# EAGLE schematic pc_badge_hrv (EAGLE 6.6.0)

## Sheet 1 of 3
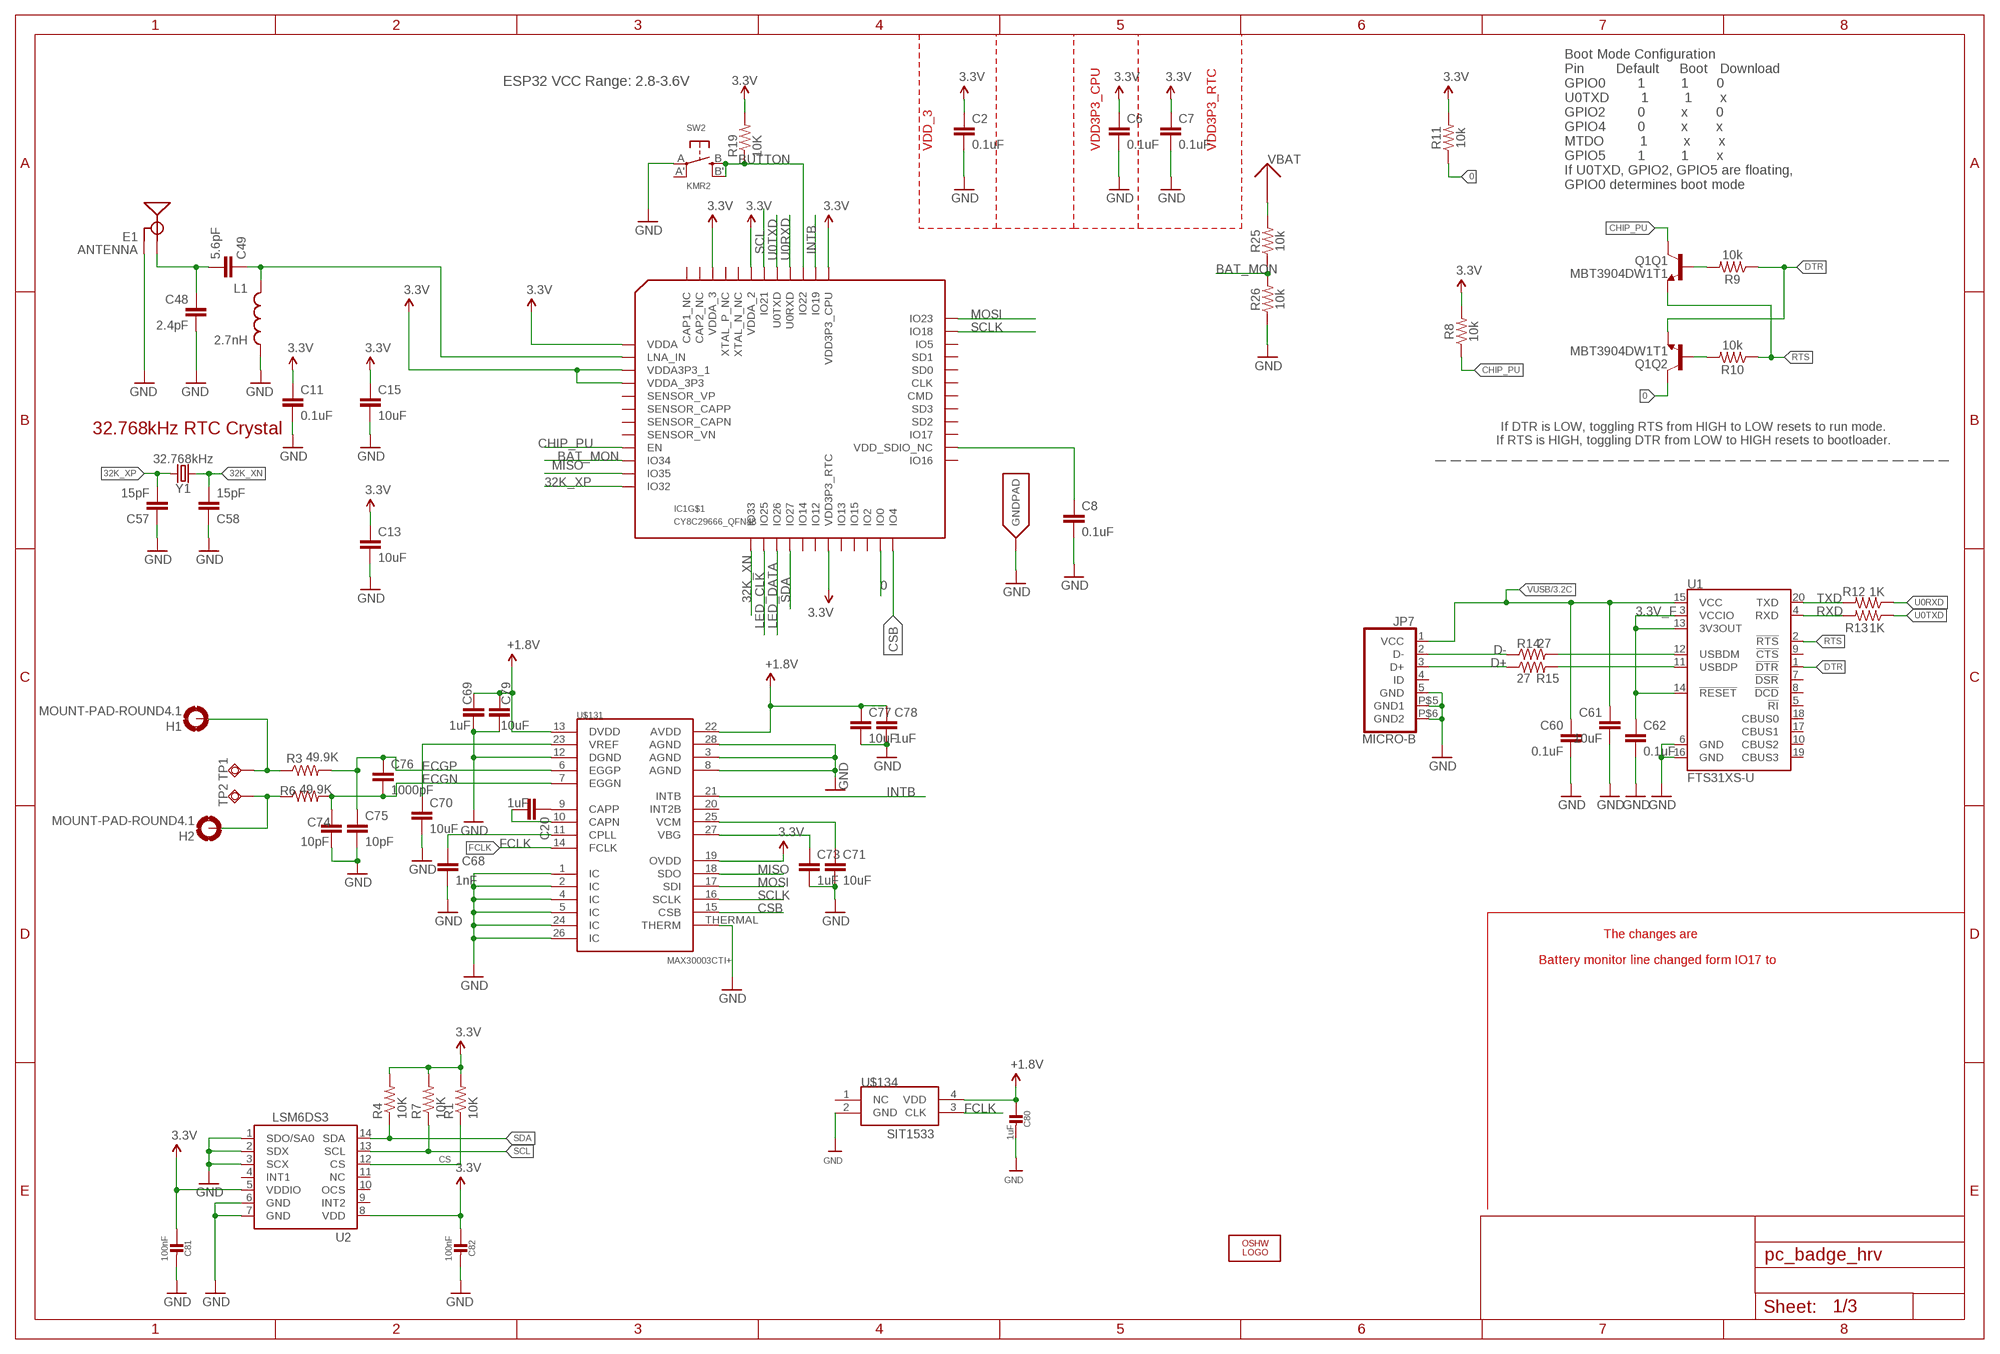
[diagram p0: schematic, sheet 1]

### Parts
C2  0.1uF  0.1UF-0402-16V-10%  [0402]
C6  0.1uF  0.1UF-0402-16V-10%  [0402]
C7  0.1uF  0.1UF-0402-16V-10%  [0402]
C8  0.1uF  0.1UF-0402-16V-10%  [0402]
C11  0.1uF  0.1UF-0402-16V-10%  [0402]
C13  10uF  10UF-0603-6.3V-20%  [0603]
C15  10uF  10UF-0603-6.3V-20%  [0603]
C20  1uF  C-EUC0402  [C0402]
C48  2.4pF  2.4PF-0603-50V-5%  [0603]
C49  5.6pF  5.6PF-50V-5%(0603)  [0603]
C57  15pF  15PF-0603-50V-5%  [0603]
C58  15pF  15PF-0603-50V-5%  [0603]
C60  0.1uF  C-EUC0402  [C0402]
C61  10uF  C-EUC0805  [C0805]
C62  0.1uF  C-EUC0402  [C0402]
C68  1nF  C-EUC0402  [C0402]
C69  1uF  C-EUC0402  [C0402]
C70  10uF  C-EUC0402  [C0402]
C71  10uF  C-EUC0402  [C0402]
C73  1uF  C-EUC0402  [C0402]
C74  10pF  C-EUC0402  [C0402]
C75  10pF  C-EUC0402  [C0402]
C76  1000pF  C-EUC0402  [C0402]
C77  10uF  C-EUC0402  [C0402]
C78  1uF  C-EUC0402  [C0402]
C79  10uF  C-EUC0402  [C0402]
C80  1uF  CAP_CERAMIC_0402  [_0402]
C81  100nF  CAP_CERAMIC_0402  [_0402]
C82  100nF  CAP_CERAMIC_0402  [_0402]
E1  ANTENNA  ANTENNATRACE-TUNED  [TRACE_ANTENNA_2.4GHZ_25.7MM_TUNED]
H1  MOUNT-PAD-ROUND4.1  [4,1-PAD]
H2  MOUNT-PAD-ROUND4.1  [4,1-PAD]
IC1  CY8C29666_QFN48  [QFN48]
JP7  MICRO-B  [MICRO-B]
L1  2.7nH  INDUCTOR0603  [0603]
LOGO3  OSHW_LOGO_FILLX0200-NT  [OSHW_FILLX200_NOTEXT]
Q1  MBT3904DW1T1  [SC70-6]
R1  10K  RESISTOR0402-RES  [0402-RES]
R3  49.9K  RESISTOR0402-RES  [0402-RES]
R4  10K  RESISTOR0402-RES  [0402-RES]
R6  49.9K  RESISTOR0402-RES  [0402-RES]
R7  10K  RESISTOR0402-RES  [0402-RES]
R8  10k  10KOHM-1/10W-1%(0603)0603  [0603]
R9  10k  10KOHM-0603-1/10W-1%  [0603]
R10  10k  10KOHM-0603-1/10W-1%  [0603]
R11  10k  10KOHM-1/10W-1%(0603)0603  [0603]
R12  1K  R-US_R0402  [R0402]
R13  1K  R-US_R0402  [R0402]
R14  27  R-US_R0402  [R0402]
R15  27  R-US_R0402  [R0402]
R19  10K  R-US_R0402  [R0402]
R25  10k  10KOHM-1/10W-1%(0603)0603  [0603]
R26  10k  10KOHM-1/10W-1%(0603)0603  [0603]
SW2  KMR2  SWITCH_TACT_SMT4.6X2.8  [BTN_KMR2_4.6X2.8]
TP1  TPSQTP11R  [TP11R]
TP2  TPSQTP11R  [TP11R]
U1  FTS31XS-U  FT231XS  [SSOP20_L]
U2  LSM6DS3  [LGA14L]
U$131  MAX30003CTI+  MAX30003  [QFN-28]
U$134  SIT1533  [SIT1533]
Y1  32.768kHz  CRYSTAL-32.768KHZSMD-3.2X1.5  [CRYSTAL-SMD-3.2X1.5MM]

### Nets
0: IC1.23(IO0) Q1.6(Q2:C) R11.1
3.3V: C2.1 C6.1 C7.1 C11.1 C13.1 C15.1 C81.1 C82.1 IC1.1(VDDA) IC1.3(VDDA3P3_1) IC1.4(VDDA_3P3) IC1.19(VDD3P3_RTC) IC1.37(VDD3P3_CPU) IC1.43(VDDA_2) IC1.46(VDDA_3) R1.2 R4.2 R7.2 R8.2 R11.2 R19.2 U2.5(VDDIO) U2.8(VDD) U$131.19(OVDD) ; also sheet 3
3.3V_F: C62.1 U1.3(VCCIO) U1.13(3V3OUT) U1.14(!RESET)
32K_XN: C58.2 IC1.13(IO33) Y1.P$2
32K_XP: C57.2 IC1.12(IO32) Y1.P$1
+1.8V: C69.1 C77.1 C78.1 C79.1 C80.1 U$131.13(DVDD) U$131.22(AVDD) U$134.4(VDD)
BAT_MON: IC1.10(IO34) R25.1 R26.2
BUTTON: IC1.39(IO22) R19.1 SW2.B'(S1) SW2.B(S)
CHIP_PU: IC1.9(EN) Q1.3(Q1:C) R8.1
CS: R1.1 U2.12(CS)
CSB: IC1.24(IO4) U$131.15(CSB)
D+: JP7.3(D+) R15.1
D-: JP7.2(D-) R14.1
DTR: Q1.1(Q2:E) R9.1 U1.1(!DTR)
ECG_N: H2.B4,1(MOUNT) R6.1 TP2.TP
ECG_P: H1.B4,1(MOUNT) R3.1 TP1.TP
ECGN: C74.1 C76.2 R6.2 U$131.7(EGGN)
ECGP: C75.1 C76.1 R3.2 U$131.6(EGGP)
FCLK: U$131.14(FCLK) U$134.3(CLK)
GND: C2.2 C6.2 C7.2 C8.2 C11.2 C13.2 C15.2 C48.2 C57.1 C58.1 C60.2 C61.2 C62.2 C68.2 C69.2 C70.2 C71.2 C73.2 C74.2 C75.2 C77.2 C78.2 C79.2 C80.2 C81.2 C82.2 E1.GND E1.GND2(GND) IC1.EXP(GNDPAD) JP7.5(GND) JP7.P$5(GND1) JP7.P$6(GND2) L1.2 R26.1 SW2.A(P) U1.6(GND) U1.16(GND) U2.1(SDO/SA0) U2.2(SDX) U2.3(SCX) U2.6(GND) U2.7(GND) U$131.1(IC) U$131.2(IC) U$131.3(AGND) U$131.4(IC) U$131.5(IC) U$131.8(AGND) U$131.12(DGND) U$131.24(IC) U$131.26(IC) U$131.28(AGND) U$131.THERMAL(THERM) U$134.2(GND) ; also sheet 2,3
INTB: IC1.38(IO19) U$131.21(INTB)
LED_CLK: IC1.14(IO25) ; also sheet 2
LED_DATA: IC1.15(IO26) ; also sheet 2
LNA_IN: C49.1 IC1.2(LNA_IN) L1.1
MISO: IC1.11(IO35) U$131.18(SDO)
MOSI: IC1.36(IO23) U$131.17(SDI)
N$1: C8.1 IC1.26(VDD_SDIO_NC)
N$4: Q1.5(Q1:B) R9.2
N$9: Q1.2(Q2:B) R10.2
N$20: R14.2 U1.12(USBDM)
N$21: R15.2 U1.11(USBDP)
N$270: C68.1 U$131.11(CPLL)
N$271: C20.1 U$131.9(CAPP)
N$272: C20.2 U$131.10(CAPN)
N$273: C70.1 U$131.23(VREF)
N$274: C71.1 U$131.25(VCM)
N$275: C73.1 U$131.27(VBG)
RTS: Q1.4(Q1:E) R10.1 U1.2(!RTS)
RXD: R13.2 U1.4(RXD)
SCL: IC1.42(IO21) R7.1 U2.13(SCL)
SCLK: IC1.35(IO18) U$131.16(SCLK)
SDA: IC1.16(IO27) R4.1 U2.14(SDA)
TRACE_ANT2: C48.1 C49.2 E1.ANT(SIGNAL)
TXD: R12.2 U1.20(TXD)
U0RXD: IC1.40(U0RXD) R12.1
U0TXD: IC1.41(U0TXD) R13.1
VBAT: R25.2 ; also sheet 3
VUSB: C60.1 C61.1 JP7.1(VCC) U1.15(VCC) ; also sheet 3
Unconnected: IC1.5(SENSOR_VP) IC1.6(SENSOR_CAPP) IC1.8(SENSOR_VN) IC1.17(IO14) IC1.20(IO13) IC1.21(IO15) IC1.22(IO2) IC1.25(IO16) IC1.27(IO17) IC1.28(SD2) IC1.29(SD3) IC1.30(CMD) IC1.31(CLK) IC1.32(SD0) IC1.33(SD1) IC1.34(IO5) IC1.44(XTAL_N_NC) IC1.45(XTAL_P_NC) IC1.47(CAP2_NC) IC1.48(CAP1_NC) JP7.4(ID) SW2.A'(P1) U1.5(!RI) U1.7(!DSR) U1.8(!DCD) U1.9(!CTS) U1.10(CBUS2) U1.17(CBUS1) U1.18(CBUS0) U1.19(CBUS3) U2.4(INT1) U2.9(INT2) U2.10(OCS) U2.11(NC) U$131.20(INT2B) U$134.1(NC)

### Notes on the sheet
- ESP32 VCC Range: 2.8-3.6V
- VDD_3 | VDD3P3_CPU | VDD3P3_RTC
- Boot Mode Configuration
  Pin        Default     Boot   Download
  GPIO0        1         1       0
  U0TXD        1         1       x
  GPIO2        0         x       0
  GPIO4        0         x       x
  MTDO         1         x       x
  GPIO5        1         1       x
  If U0TXD, GPIO2, GPIO5 are floating, 
  GPIO0 determines boot mode
- 32.768kHz RTC Crystal
- If DTR is LOW, toggling RTS from HIGH to LOW resets to run mode.
  If RTS is HIGH, toggling DTR from LOW to HIGH resets to bootloader.
- The changes are
- Battery monitor line changed form IO17 to

## Sheet 2 of 3
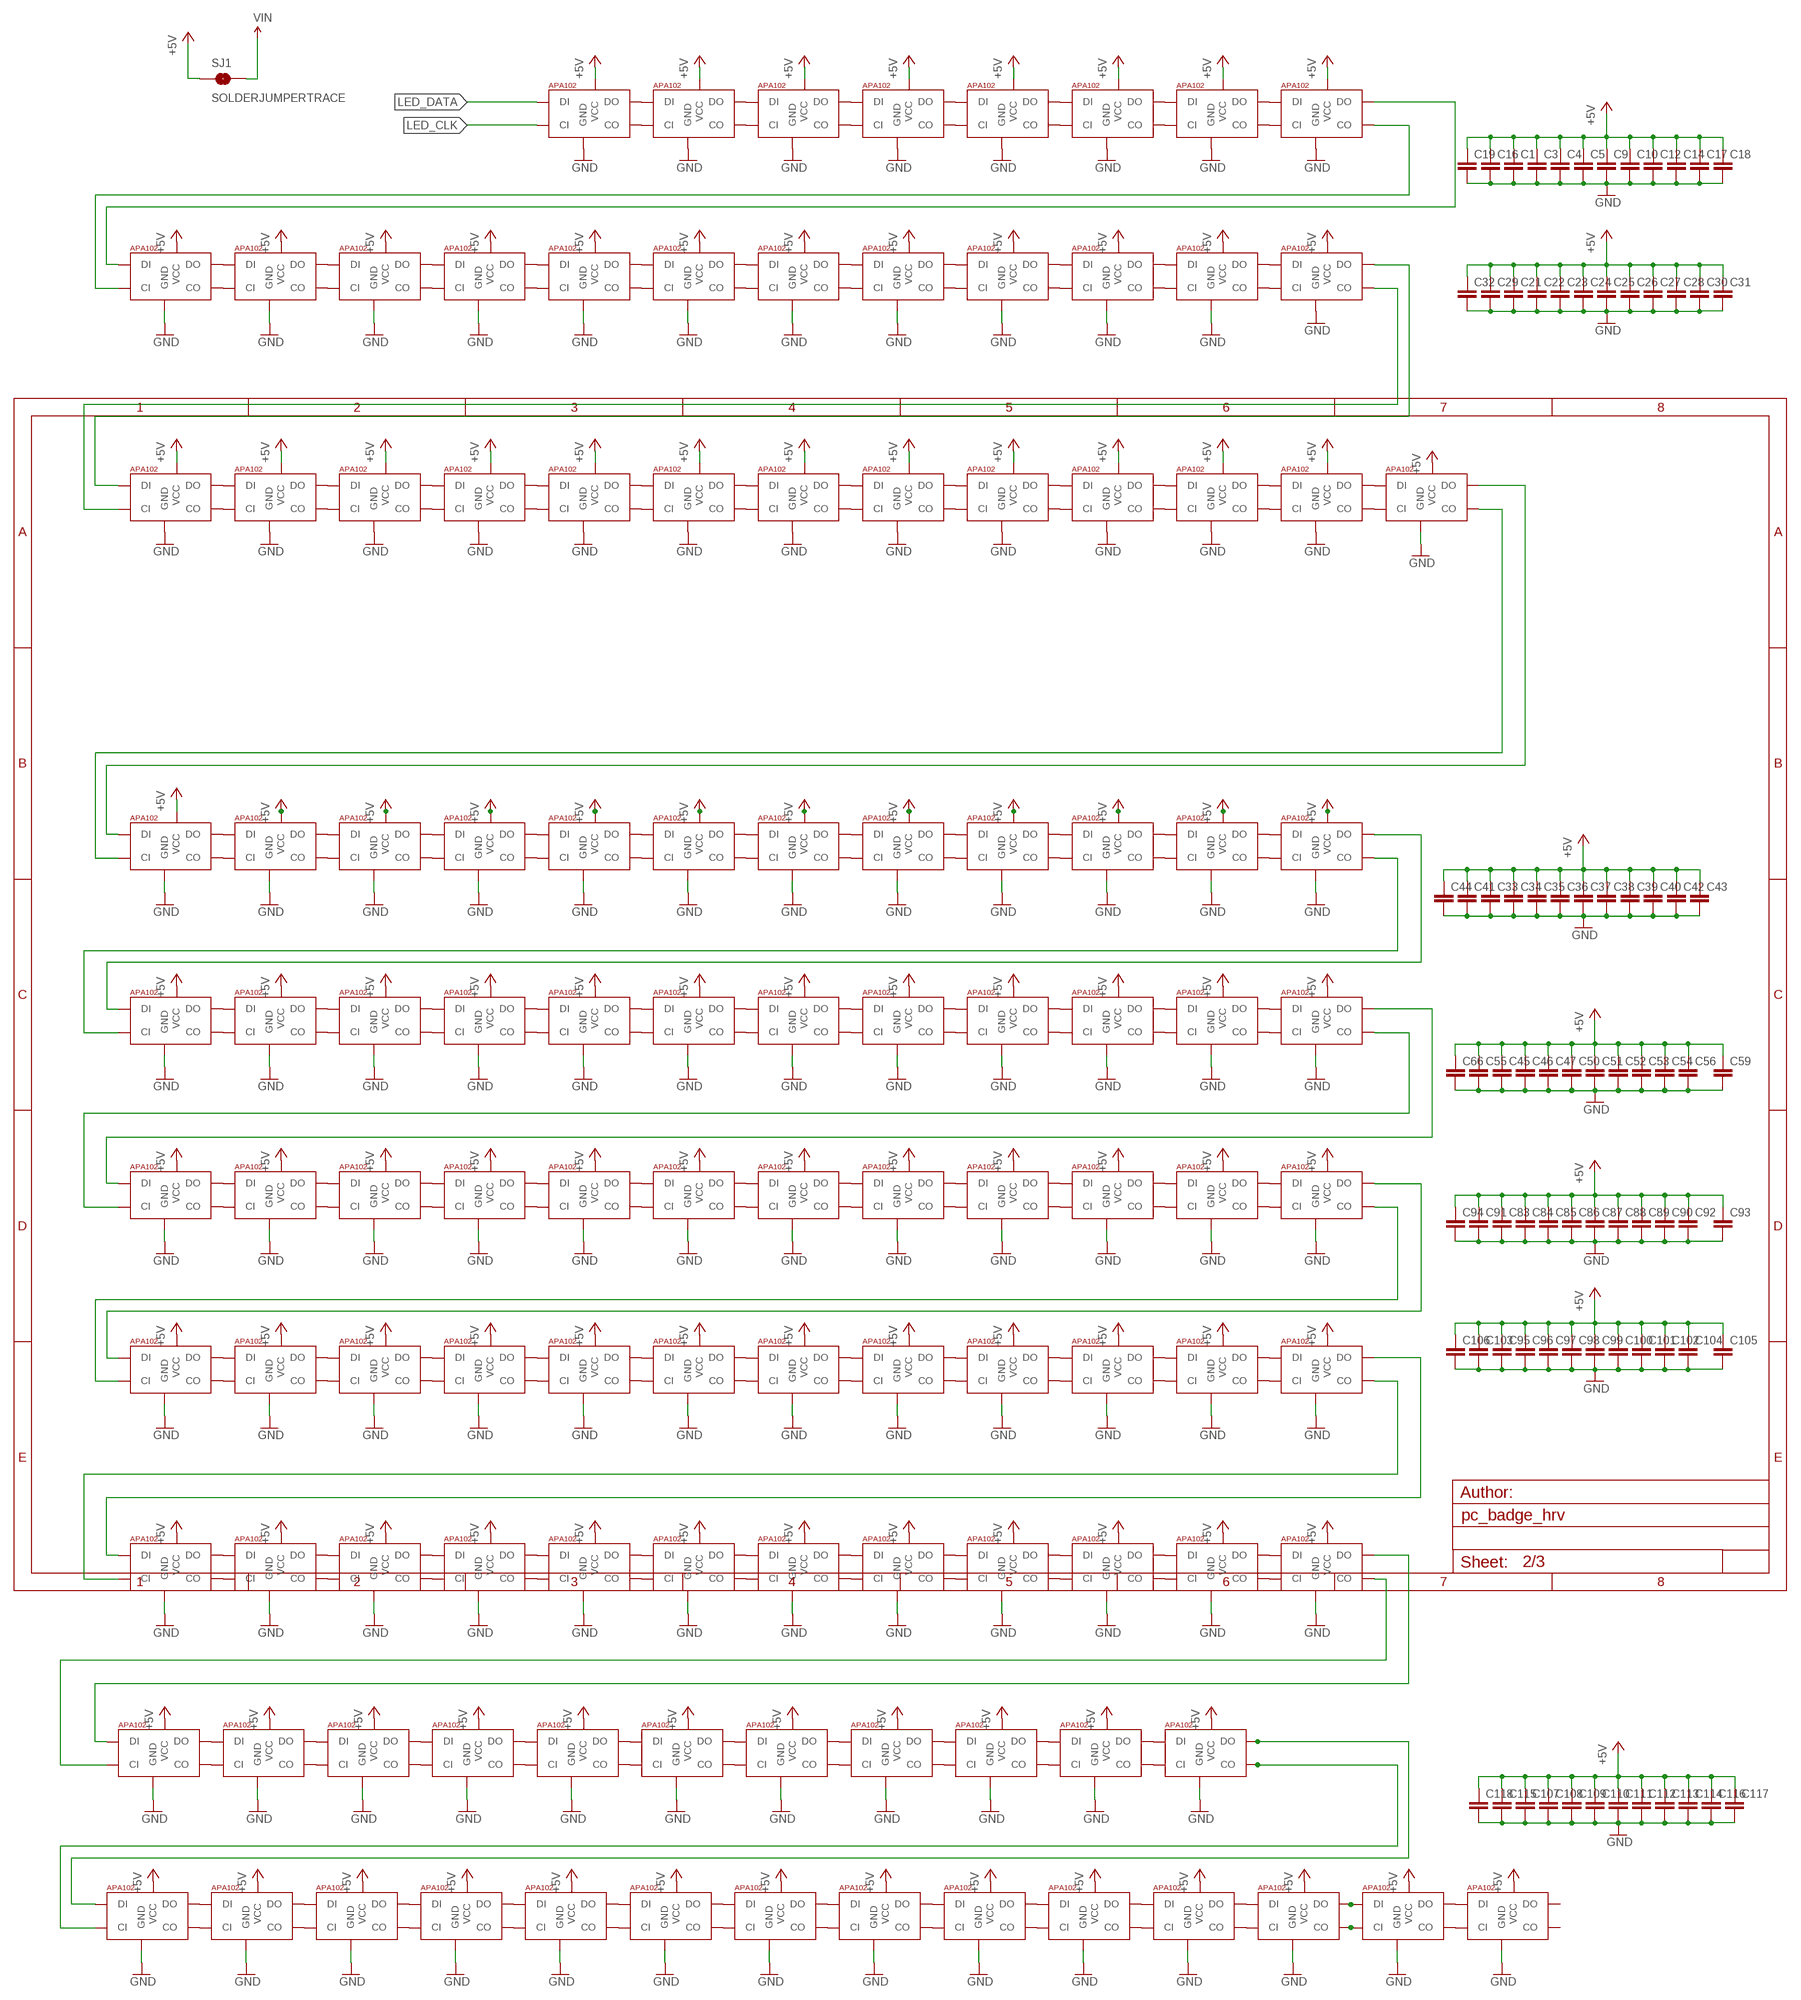
[diagram p1: schematic, sheet 2]

### Parts
C1  C-EUC0402K  [C0402K]
C3  C-EUC0402K  [C0402K]
C4  C-EUC0402K  [C0402K]
C5  C-EUC0402K  [C0402K]
C9  C-EUC0402K  [C0402K]
C10  C-EUC0402K  [C0402K]
C12  C-EUC0402K  [C0402K]
C14  C-EUC0402K  [C0402K]
C16  C-EUC0402K  [C0402K]
C17  C-EUC0402K  [C0402K]
C18  C-EUC0402K  [C0402K]
C19  C-EUC0402K  [C0402K]
C21  C-EUC0402K  [C0402K]
C22  C-EUC0402K  [C0402K]
C23  C-EUC0402K  [C0402K]
C24  C-EUC0402K  [C0402K]
C25  C-EUC0402K  [C0402K]
C26  C-EUC0402K  [C0402K]
C27  C-EUC0402K  [C0402K]
C28  C-EUC0402K  [C0402K]
C29  C-EUC0402K  [C0402K]
C30  C-EUC0402K  [C0402K]
C31  C-EUC0402K  [C0402K]
C32  C-EUC0402K  [C0402K]
C33  C-EUC0402K  [C0402K]
C34  C-EUC0402K  [C0402K]
C35  C-EUC0402K  [C0402K]
C36  C-EUC0402K  [C0402K]
C37  C-EUC0402K  [C0402K]
C38  C-EUC0402K  [C0402K]
C39  C-EUC0402K  [C0402K]
C40  C-EUC0402K  [C0402K]
C41  C-EUC0402K  [C0402K]
C42  C-EUC0402K  [C0402K]
C43  C-EUC0402K  [C0402K]
C44  C-EUC0402K  [C0402K]
C45  C-EUC0402K  [C0402K]
C46  C-EUC0402K  [C0402K]
C47  C-EUC0402K  [C0402K]
C50  C-EUC0402K  [C0402K]
C51  C-EUC0402K  [C0402K]
C52  C-EUC0402K  [C0402K]
C53  C-EUC0402K  [C0402K]
C54  C-EUC0402K  [C0402K]
C55  C-EUC0402K  [C0402K]
C56  C-EUC0402K  [C0402K]
C59  C-EUC0402K  [C0402K]
C66  C-EUC0402K  [C0402K]
C83  C-EUC0402K  [C0402K]
C84  C-EUC0402K  [C0402K]
C85  C-EUC0402K  [C0402K]
C86  C-EUC0402K  [C0402K]
C87  C-EUC0402K  [C0402K]
C88  C-EUC0402K  [C0402K]
C89  C-EUC0402K  [C0402K]
C90  C-EUC0402K  [C0402K]
C91  C-EUC0402K  [C0402K]
C92  C-EUC0402K  [C0402K]
C93  C-EUC0402K  [C0402K]
C94  C-EUC0402K  [C0402K]
C95  C-EUC0402K  [C0402K]
C96  C-EUC0402K  [C0402K]
C97  C-EUC0402K  [C0402K]
C98  C-EUC0402K  [C0402K]
C99  C-EUC0402K  [C0402K]
C100  C-EUC0402K  [C0402K]
C101  C-EUC0402K  [C0402K]
C102  C-EUC0402K  [C0402K]
C103  C-EUC0402K  [C0402K]
C104  C-EUC0402K  [C0402K]
C105  C-EUC0402K  [C0402K]
C106  C-EUC0402K  [C0402K]
C107  C-EUC0402K  [C0402K]
C108  C-EUC0402K  [C0402K]
C109  C-EUC0402K  [C0402K]
C110  C-EUC0402K  [C0402K]
C111  C-EUC0402K  [C0402K]
C112  C-EUC0402K  [C0402K]
C113  C-EUC0402K  [C0402K]
C114  C-EUC0402K  [C0402K]
C115  C-EUC0402K  [C0402K]
C116  C-EUC0402K  [C0402K]
C117  C-EUC0402K  [C0402K]
C118  C-EUC0402K  [C0402K]
SJ1  SOLDERJUMPERTRACE  [SJ_2S-TRACE]
U$9  APA1022020  [APA102_2020]
U$10  APA1022020  [APA102_2020]
U$11  APA1022020  [APA102_2020]
U$12  APA1022020  [APA102_2020]
U$13  APA1022020  [APA102_2020]
U$14  APA1022020  [APA102_2020]
U$15  APA1022020  [APA102_2020]
U$18  APA1022020  [APA102_2020]
U$19  APA1022020  [APA102_2020]
U$20  APA1022020  [APA102_2020]
U$21  APA1022020  [APA102_2020]
U$22  APA1022020  [APA102_2020]
U$24  APA1022020  [APA102_2020]
U$25  APA1022020  [APA102_2020]
U$27  APA1022020  [APA102_2020]
U$28  APA1022020  [APA102_2020]
U$29  APA1022020  [APA102_2020]
U$30  APA1022020  [APA102_2020]
U$31  APA1022020  [APA102_2020]
U$32  APA1022020  [APA102_2020]
U$33  APA1022020  [APA102_2020]
U$34  APA1022020  [APA102_2020]
U$35  APA1022020  [APA102_2020]
U$36  APA1022020  [APA102_2020]
U$37  APA1022020  [APA102_2020]
U$38  APA1022020  [APA102_2020]
U$39  APA1022020  [APA102_2020]
U$40  APA1022020  [APA102_2020]
U$41  APA1022020  [APA102_2020]
U$42  APA1022020  [APA102_2020]
U$43  APA1022020  [APA102_2020]
U$44  APA1022020  [APA102_2020]
U$45  APA1022020  [APA102_2020]
U$46  APA1022020  [APA102_2020]
U$47  APA1022020  [APA102_2020]
U$48  APA1022020  [APA102_2020]
U$49  APA1022020  [APA102_2020]
U$50  APA1022020  [APA102_2020]
U$51  APA1022020  [APA102_2020]
U$52  APA1022020  [APA102_2020]
U$53  APA1022020  [APA102_2020]
U$54  APA1022020  [APA102_2020]
U$55  APA1022020  [APA102_2020]
U$56  APA1022020  [APA102_2020]
U$57  APA1022020  [APA102_2020]
U$58  APA1022020  [APA102_2020]
U$59  APA1022020  [APA102_2020]
U$60  APA1022020  [APA102_2020]
U$61  APA1022020  [APA102_2020]
U$62  APA1022020  [APA102_2020]
U$63  APA1022020  [APA102_2020]
U$64  APA1022020  [APA102_2020]
U$65  APA1022020  [APA102_2020]
U$66  APA1022020  [APA102_2020]
U$67  APA1022020  [APA102_2020]
U$68  APA1022020  [APA102_2020]
U$69  APA1022020  [APA102_2020]
U$70  APA1022020  [APA102_2020]
U$71  APA1022020  [APA102_2020]
U$72  APA1022020  [APA102_2020]
U$73  APA1022020  [APA102_2020]
U$74  APA1022020  [APA102_2020]
U$75  APA1022020  [APA102_2020]
U$76  APA1022020  [APA102_2020]
U$77  APA1022020  [APA102_2020]
U$78  APA1022020  [APA102_2020]
U$79  APA1022020  [APA102_2020]
U$80  APA1022020  [APA102_2020]
U$81  APA1022020  [APA102_2020]
U$82  APA1022020  [APA102_2020]
U$83  APA1022020  [APA102_2020]
U$84  APA1022020  [APA102_2020]
U$85  APA1022020  [APA102_2020]
U$86  APA1022020  [APA102_2020]
U$87  APA1022020  [APA102_2020]
U$88  APA1022020  [APA102_2020]
U$89  APA1022020  [APA102_2020]
U$90  APA1022020  [APA102_2020]
U$91  APA1022020  [APA102_2020]
U$92  APA1022020  [APA102_2020]
U$93  APA1022020  [APA102_2020]
U$94  APA1022020  [APA102_2020]
U$95  APA1022020  [APA102_2020]
U$96  APA1022020  [APA102_2020]
U$97  APA1022020  [APA102_2020]
U$98  APA1022020  [APA102_2020]
U$99  APA1022020  [APA102_2020]
U$100  APA1022020  [APA102_2020]
U$101  APA1022020  [APA102_2020]
U$102  APA1022020  [APA102_2020]
U$103  APA1022020  [APA102_2020]
U$104  APA1022020  [APA102_2020]
U$105  APA1022020  [APA102_2020]
U$106  APA1022020  [APA102_2020]
U$107  APA1022020  [APA102_2020]
U$108  APA1022020  [APA102_2020]
U$109  APA1022020  [APA102_2020]
U$110  APA1022020  [APA102_2020]
U$111  APA1022020  [APA102_2020]
U$112  APA1022020  [APA102_2020]
U$113  APA1022020  [APA102_2020]
U$114  APA1022020  [APA102_2020]
U$115  APA1022020  [APA102_2020]
U$116  APA1022020  [APA102_2020]
U$117  APA1022020  [APA102_2020]
U$118  APA1022020  [APA102_2020]
U$119  APA1022020  [APA102_2020]
U$120  APA1022020  [APA102_2020]
U$121  APA1022020  [APA102_2020]
U$122  APA1022020  [APA102_2020]
U$123  APA1022020  [APA102_2020]
U$124  APA1022020  [APA102_2020]
U$125  APA1022020  [APA102_2020]
U$126  APA1022020  [APA102_2020]
U$127  APA1022020  [APA102_2020]
U$128  APA1022020  [APA102_2020]
U$129  APA1022020  [APA102_2020]
U$130  APA1022020  [APA102_2020]

### Nets
+5V: C1.1 C3.1 C4.1 C5.1 C9.1 C10.1 C12.1 C14.1 C16.1 C17.1 C18.1 C19.1 C21.1 C22.1 C23.1 C24.1 C25.1 C26.1 C27.1 C28.1 C29.1 C30.1 C31.1 C32.1 C33.1 C34.1 C35.1 C36.1 C37.1 C38.1 C39.1 C40.1 C41.1 C42.1 C43.1 C44.1 C45.1 C46.1 C47.1 C50.1 C51.1 C52.1 C53.1 C54.1 C55.1 C56.1 C59.1 C66.1 C83.1 C84.1 C85.1 C86.1 C87.1 C88.1 C89.1 C90.1 C91.1 C92.1 C93.1 C94.1 C95.1 C96.1 C97.1 C98.1 C99.1 C100.1 C101.1 C102.1 C103.1 C104.1 C105.1 C106.1 C107.1 C108.1 C109.1 C110.1 C111.1 C112.1 C113.1 C114.1 C115.1 C116.1 C117.1 C118.1 SJ1.1 U$9.V_CC(VCC) U$10.V_CC(VCC) U$11.V_CC(VCC) U$12.V_CC(VCC) U$13.V_CC(VCC) U$14.V_CC(VCC) U$15.V_CC(VCC) U$18.V_CC(VCC) U$19.V_CC(VCC) U$20.V_CC(VCC) U$21.V_CC(VCC) U$22.V_CC(VCC) U$24.V_CC(VCC) U$25.V_CC(VCC) U$27.V_CC(VCC) U$28.V_CC(VCC) U$29.V_CC(VCC) U$30.V_CC(VCC) U$31.V_CC(VCC) U$32.V_CC(VCC) U$33.V_CC(VCC) U$34.V_CC(VCC) U$35.V_CC(VCC) U$36.V_CC(VCC) U$37.V_CC(VCC) U$38.V_CC(VCC) U$39.V_CC(VCC) U$40.V_CC(VCC) U$41.V_CC(VCC) U$42.V_CC(VCC) U$43.V_CC(VCC) U$44.V_CC(VCC) U$45.V_CC(VCC) U$46.V_CC(VCC) U$47.V_CC(VCC) U$48.V_CC(VCC) U$49.V_CC(VCC) U$50.V_CC(VCC) U$51.V_CC(VCC) U$52.V_CC(VCC) U$53.V_CC(VCC) U$54.V_CC(VCC) U$55.V_CC(VCC) U$56.V_CC(VCC) U$57.V_CC(VCC) U$58.V_CC(VCC) U$59.V_CC(VCC) U$60.V_CC(VCC) U$61.V_CC(VCC) U$62.V_CC(VCC) U$63.V_CC(VCC) U$64.V_CC(VCC) U$65.V_CC(VCC) U$66.V_CC(VCC) U$67.V_CC(VCC) U$68.V_CC(VCC) U$69.V_CC(VCC) U$70.V_CC(VCC) U$71.V_CC(VCC) U$72.V_CC(VCC) U$73.V_CC(VCC) U$74.V_CC(VCC) U$75.V_CC(VCC) U$76.V_CC(VCC) U$77.V_CC(VCC) U$78.V_CC(VCC) U$79.V_CC(VCC) U$80.V_CC(VCC) U$81.V_CC(VCC) U$82.V_CC(VCC) U$83.V_CC(VCC) U$84.V_CC(VCC) U$85.V_CC(VCC) U$86.V_CC(VCC) U$87.V_CC(VCC) U$88.V_CC(VCC) U$89.V_CC(VCC) U$90.V_CC(VCC) U$91.V_CC(VCC) U$92.V_CC(VCC) U$93.V_CC(VCC) U$94.V_CC(VCC) U$95.V_CC(VCC) U$96.V_CC(VCC) U$97.V_CC(VCC) U$98.V_CC(VCC) U$99.V_CC(VCC) U$100.V_CC(VCC) U$101.V_CC(VCC) U$102.V_CC(VCC) U$103.V_CC(VCC) U$104.V_CC(VCC) U$105.V_CC(VCC) U$106.V_CC(VCC) U$107.V_CC(VCC) U$108.V_CC(VCC) U$109.V_CC(VCC) U$110.V_CC(VCC) U$111.V_CC(VCC) U$112.V_CC(VCC) U$113.V_CC(VCC) U$114.V_CC(VCC) U$115.V_CC(VCC) U$116.V_CC(VCC) U$117.V_CC(VCC) U$118.V_CC(VCC) U$119.V_CC(VCC) U$120.V_CC(VCC) U$121.V_CC(VCC) U$122.V_CC(VCC) U$123.V_CC(VCC) U$124.V_CC(VCC) U$125.V_CC(VCC) U$126.V_CC(VCC) U$127.V_CC(VCC) U$128.V_CC(VCC) U$129.V_CC(VCC) U$130.V_CC(VCC)
GND: C1.2 C3.2 C4.2 C5.2 C9.2 C10.2 C12.2 C14.2 C16.2 C17.2 C18.2 C19.2 C21.2 C22.2 C23.2 C24.2 C25.2 C26.2 C27.2 C28.2 C29.2 C30.2 C31.2 C32.2 C33.2 C34.2 C35.2 C36.2 C37.2 C38.2 C39.2 C40.2 C41.2 C42.2 C43.2 C44.2 C45.2 C46.2 C47.2 C50.2 C51.2 C52.2 C53.2 C54.2 C55.2 C56.2 C59.2 C66.2 C83.2 C84.2 C85.2 C86.2 C87.2 C88.2 C89.2 C90.2 C91.2 C92.2 C93.2 C94.2 C95.2 C96.2 C97.2 C98.2 C99.2 C100.2 C101.2 C102.2 C103.2 C104.2 C105.2 C106.2 C107.2 C108.2 C109.2 C110.2 C111.2 C112.2 C113.2 C114.2 C115.2 C116.2 C117.2 C118.2 U$9.GND U$10.GND U$11.GND U$12.GND U$13.GND U$14.GND U$15.GND U$18.GND U$19.GND U$20.GND U$21.GND U$22.GND U$24.GND U$25.GND U$27.GND U$28.GND U$29.GND U$30.GND U$31.GND U$32.GND U$33.GND U$34.GND U$35.GND U$36.GND U$37.GND U$38.GND U$39.GND U$40.GND U$41.GND U$42.GND U$43.GND U$44.GND U$45.GND U$46.GND U$47.GND U$48.GND U$49.GND U$50.GND U$51.GND U$52.GND U$53.GND U$54.GND U$55.GND U$56.GND U$57.GND U$58.GND U$59.GND U$60.GND U$61.GND U$62.GND U$63.GND U$64.GND U$65.GND U$66.GND U$67.GND U$68.GND U$69.GND U$70.GND U$71.GND U$72.GND U$73.GND U$74.GND U$75.GND U$76.GND U$77.GND U$78.GND U$79.GND U$80.GND U$81.GND U$82.GND U$83.GND U$84.GND U$85.GND U$86.GND U$87.GND U$88.GND U$89.GND U$90.GND U$91.GND U$92.GND U$93.GND U$94.GND U$95.GND U$96.GND U$97.GND U$98.GND U$99.GND U$100.GND U$101.GND U$102.GND U$103.GND U$104.GND U$105.GND U$106.GND U$107.GND U$108.GND U$109.GND U$110.GND U$111.GND U$112.GND U$113.GND U$114.GND U$115.GND U$116.GND U$117.GND U$118.GND U$119.GND U$120.GND U$121.GND U$122.GND U$123.GND U$124.GND U$125.GND U$126.GND U$127.GND U$128.GND U$129.GND U$130.GND ; also sheet 1,3
LED_CLK: U$9.C_IN(CI) ; also sheet 1
LED_DATA: U$9.D_IN(DI) ; also sheet 1
N$3: U$104.D_OUT(DO) U$119.D_IN(DI)
N$7: U$104.CL_OUT(CO) U$119.C_IN(CI)
N$24: U$9.D_OUT(DO) U$10.D_IN(DI)
N$25: U$9.CL_OUT(CO) U$10.C_IN(CI)
N$26: U$11.D_OUT(DO) U$12.D_IN(DI)
N$27: U$11.CL_OUT(CO) U$12.C_IN(CI)
N$28: U$12.D_OUT(DO) U$13.D_IN(DI)
N$30: U$12.CL_OUT(CO) U$13.C_IN(CI)
N$32: U$13.D_OUT(DO) U$14.D_IN(DI)
N$33: U$13.CL_OUT(CO) U$14.C_IN(CI)
N$34: U$14.D_OUT(DO) U$15.D_IN(DI)
N$35: U$14.CL_OUT(CO) U$15.C_IN(CI)
N$36: U$15.D_OUT(DO) U$18.D_IN(DI)
N$37: U$15.CL_OUT(CO) U$18.C_IN(CI)
N$38: U$10.D_OUT(DO) U$11.D_IN(DI)
N$39: U$10.CL_OUT(CO) U$11.C_IN(CI)
N$40: U$19.D_OUT(DO) U$20.D_IN(DI)
N$41: U$19.CL_OUT(CO) U$20.C_IN(CI)
N$42: U$20.D_OUT(DO) U$21.D_IN(DI)
N$43: U$20.CL_OUT(CO) U$21.C_IN(CI)
N$44: U$21.D_OUT(DO) U$22.D_IN(DI)
N$45: U$21.CL_OUT(CO) U$22.C_IN(CI)
N$46: U$22.D_OUT(DO) U$24.D_IN(DI)
N$47: U$22.CL_OUT(CO) U$24.C_IN(CI)
N$48: U$24.D_OUT(DO) U$25.D_IN(DI)
N$50: U$24.CL_OUT(CO) U$25.C_IN(CI)
N$56: U$27.D_OUT(DO) U$28.D_IN(DI)
N$57: U$27.CL_OUT(CO) U$28.C_IN(CI)
N$58: U$28.D_OUT(DO) U$29.D_IN(DI)
N$59: U$28.CL_OUT(CO) U$29.C_IN(CI)
N$60: U$29.D_OUT(DO) U$30.D_IN(DI)
N$61: U$29.CL_OUT(CO) U$30.C_IN(CI)
N$62: U$30.D_OUT(DO) U$31.D_IN(DI)
N$63: U$30.CL_OUT(CO) U$31.C_IN(CI)
N$64: U$119.D_OUT(DO) U$120.D_IN(DI)
N$65: U$119.CL_OUT(CO) U$120.C_IN(CI)
N$66: U$25.D_OUT(DO) U$27.D_IN(DI)
N$67: U$25.CL_OUT(CO) U$27.C_IN(CI)
N$68: U$33.D_OUT(DO) U$34.D_IN(DI)
N$69: U$33.CL_OUT(CO) U$34.C_IN(CI)
N$70: U$34.D_OUT(DO) U$35.D_IN(DI)
N$71: U$34.CL_OUT(CO) U$35.C_IN(CI)
N$72: U$35.D_OUT(DO) U$36.D_IN(DI)
N$73: U$35.CL_OUT(CO) U$36.C_IN(CI)
N$80: U$36.D_OUT(DO) U$37.D_IN(DI)
N$81: U$36.CL_OUT(CO) U$37.C_IN(CI)
N$82: U$37.D_OUT(DO) U$38.D_IN(DI)
N$83: U$37.CL_OUT(CO) U$38.C_IN(CI)
N$84: U$39.D_OUT(DO) U$40.D_IN(DI)
N$85: U$39.CL_OUT(CO) U$40.C_IN(CI)
N$86: U$40.D_OUT(DO) U$41.D_IN(DI)
N$87: U$40.CL_OUT(CO) U$41.C_IN(CI)
N$88: U$41.D_OUT(DO) U$42.D_IN(DI)
N$89: U$41.CL_OUT(CO) U$42.C_IN(CI)
N$90: U$42.D_OUT(DO) U$43.D_IN(DI)
N$91: U$42.CL_OUT(CO) U$43.C_IN(CI)
N$92: U$43.D_OUT(DO) U$44.D_IN(DI)
N$93: U$43.CL_OUT(CO) U$44.C_IN(CI)
N$94: U$38.D_OUT(DO) U$39.D_IN(DI)
N$95: U$38.CL_OUT(CO) U$39.C_IN(CI)
N$96: U$45.D_OUT(DO) U$46.D_IN(DI)
N$97: U$45.CL_OUT(CO) U$46.C_IN(CI)
N$98: U$46.D_OUT(DO) U$47.D_IN(DI)
N$99: U$46.CL_OUT(CO) U$47.C_IN(CI)
N$100: U$47.D_OUT(DO) U$48.D_IN(DI)
N$101: U$47.CL_OUT(CO) U$48.C_IN(CI)
N$102: U$48.D_OUT(DO) U$49.D_IN(DI)
N$103: U$48.CL_OUT(CO) U$49.C_IN(CI)
N$104: U$49.D_OUT(DO) U$50.D_IN(DI)
N$105: U$49.CL_OUT(CO) U$50.C_IN(CI)
N$106: U$51.D_OUT(DO) U$52.D_IN(DI)
N$107: U$51.CL_OUT(CO) U$52.C_IN(CI)
N$108: U$52.D_OUT(DO) U$53.D_IN(DI)
N$109: U$52.CL_OUT(CO) U$53.C_IN(CI)
N$110: U$53.D_OUT(DO) U$54.D_IN(DI)
N$111: U$53.CL_OUT(CO) U$54.C_IN(CI)
N$112: U$54.D_OUT(DO) U$55.D_IN(DI)
N$113: U$54.CL_OUT(CO) U$55.C_IN(CI)
N$114: U$55.D_OUT(DO) U$56.D_IN(DI)
N$115: U$55.CL_OUT(CO) U$56.C_IN(CI)
N$116: U$50.D_OUT(DO) U$51.D_IN(DI)
N$117: U$50.CL_OUT(CO) U$51.C_IN(CI)
N$118: U$18.D_OUT(DO) U$19.D_IN(DI)
N$119: U$18.CL_OUT(CO) U$19.C_IN(CI)
N$120: U$32.D_OUT(DO) U$33.D_IN(DI)
N$121: U$32.CL_OUT(CO) U$33.C_IN(CI)
N$122: U$44.CL_OUT(CO) U$45.C_IN(CI)
N$123: U$44.D_OUT(DO) U$45.D_IN(DI)
N$124: U$57.D_OUT(DO) U$58.D_IN(DI)
N$125: U$57.CL_OUT(CO) U$58.C_IN(CI)
N$126: U$58.D_OUT(DO) U$59.D_IN(DI)
N$127: U$58.CL_OUT(CO) U$59.C_IN(CI)
N$128: U$59.D_OUT(DO) U$60.D_IN(DI)
N$129: U$59.CL_OUT(CO) U$60.C_IN(CI)
N$130: U$60.D_OUT(DO) U$61.D_IN(DI)
N$131: U$60.CL_OUT(CO) U$61.C_IN(CI)
N$132: U$61.D_OUT(DO) U$62.D_IN(DI)
N$133: U$61.CL_OUT(CO) U$62.C_IN(CI)
N$134: U$63.D_OUT(DO) U$64.D_IN(DI)
N$135: U$63.CL_OUT(CO) U$64.C_IN(CI)
N$136: U$64.D_OUT(DO) U$65.D_IN(DI)
N$137: U$64.CL_OUT(CO) U$65.C_IN(CI)
N$138: U$65.D_OUT(DO) U$66.D_IN(DI)
N$139: U$65.CL_OUT(CO) U$66.C_IN(CI)
N$140: U$66.D_OUT(DO) U$67.D_IN(DI)
N$141: U$66.CL_OUT(CO) U$67.C_IN(CI)
N$142: U$67.D_OUT(DO) U$68.D_IN(DI)
N$143: U$67.CL_OUT(CO) U$68.C_IN(CI)
N$144: U$62.D_OUT(DO) U$63.D_IN(DI)
N$145: U$62.CL_OUT(CO) U$63.C_IN(CI)
N$146: U$56.CL_OUT(CO) U$57.C_IN(CI)
N$147: U$56.D_OUT(DO) U$57.D_IN(DI)
N$148: U$69.D_OUT(DO) U$70.D_IN(DI)
N$149: U$69.CL_OUT(CO) U$70.C_IN(CI)
N$150: U$70.D_OUT(DO) U$71.D_IN(DI)
N$151: U$70.CL_OUT(CO) U$71.C_IN(CI)
N$152: U$71.D_OUT(DO) U$72.D_IN(DI)
N$153: U$71.CL_OUT(CO) U$72.C_IN(CI)
N$154: U$72.D_OUT(DO) U$73.D_IN(DI)
N$155: U$72.CL_OUT(CO) U$73.C_IN(CI)
N$156: U$73.D_OUT(DO) U$74.D_IN(DI)
N$157: U$73.CL_OUT(CO) U$74.C_IN(CI)
N$158: U$75.D_OUT(DO) U$76.D_IN(DI)
N$159: U$75.CL_OUT(CO) U$76.C_IN(CI)
N$160: U$76.D_OUT(DO) U$77.D_IN(DI)
N$161: U$76.CL_OUT(CO) U$77.C_IN(CI)
N$162: U$77.D_OUT(DO) U$78.D_IN(DI)
N$163: U$77.CL_OUT(CO) U$78.C_IN(CI)
N$164: U$78.D_OUT(DO) U$79.D_IN(DI)
N$165: U$78.CL_OUT(CO) U$79.C_IN(CI)
N$166: U$79.D_OUT(DO) U$80.D_IN(DI)
N$167: U$79.CL_OUT(CO) U$80.C_IN(CI)
N$168: U$74.D_OUT(DO) U$75.D_IN(DI)
N$169: U$74.CL_OUT(CO) U$75.C_IN(CI)
N$170: U$68.CL_OUT(CO) U$69.C_IN(CI)
N$171: U$68.D_OUT(DO) U$69.D_IN(DI)
N$172: U$81.D_OUT(DO) U$82.D_IN(DI)
N$173: U$81.CL_OUT(CO) U$82.C_IN(CI)
N$174: U$82.D_OUT(DO) U$83.D_IN(DI)
N$175: U$82.CL_OUT(CO) U$83.C_IN(CI)
N$176: U$83.D_OUT(DO) U$84.D_IN(DI)
N$177: U$83.CL_OUT(CO) U$84.C_IN(CI)
N$178: U$84.D_OUT(DO) U$85.D_IN(DI)
N$179: U$84.CL_OUT(CO) U$85.C_IN(CI)
N$180: U$85.D_OUT(DO) U$86.D_IN(DI)
N$181: U$85.CL_OUT(CO) U$86.C_IN(CI)
N$182: U$87.D_OUT(DO) U$88.D_IN(DI)
N$183: U$87.CL_OUT(CO) U$88.C_IN(CI)
N$184: U$88.D_OUT(DO) U$89.D_IN(DI)
N$185: U$88.CL_OUT(CO) U$89.C_IN(CI)
N$186: U$89.D_OUT(DO) U$90.D_IN(DI)
N$187: U$89.CL_OUT(CO) U$90.C_IN(CI)
N$188: U$90.D_OUT(DO) U$91.D_IN(DI)
N$189: U$90.CL_OUT(CO) U$91.C_IN(CI)
N$190: U$91.D_OUT(DO) U$92.D_IN(DI)
N$191: U$91.CL_OUT(CO) U$92.C_IN(CI)
N$192: U$86.D_OUT(DO) U$87.D_IN(DI)
N$193: U$86.CL_OUT(CO) U$87.C_IN(CI)
N$194: U$80.CL_OUT(CO) U$81.C_IN(CI)
N$195: U$80.D_OUT(DO) U$81.D_IN(DI)
N$196: U$93.D_OUT(DO) U$94.D_IN(DI)
N$197: U$93.CL_OUT(CO) U$94.C_IN(CI)
N$198: U$94.D_OUT(DO) U$95.D_IN(DI)
N$199: U$94.CL_OUT(CO) U$95.C_IN(CI)
N$200: U$95.D_OUT(DO) U$96.D_IN(DI)
N$201: U$95.CL_OUT(CO) U$96.C_IN(CI)
N$202: U$96.D_OUT(DO) U$97.D_IN(DI)
N$203: U$96.CL_OUT(CO) U$97.C_IN(CI)
N$204: U$97.D_OUT(DO) U$98.D_IN(DI)
N$205: U$97.CL_OUT(CO) U$98.C_IN(CI)
N$206: U$99.D_OUT(DO) U$100.D_IN(DI)
N$207: U$99.CL_OUT(CO) U$100.C_IN(CI)
N$208: U$100.D_OUT(DO) U$101.D_IN(DI)
N$209: U$100.CL_OUT(CO) U$101.C_IN(CI)
N$210: U$101.D_OUT(DO) U$102.D_IN(DI)
N$211: U$101.CL_OUT(CO) U$102.C_IN(CI)
N$212: U$102.D_OUT(DO) U$103.D_IN(DI)
N$213: U$102.CL_OUT(CO) U$103.C_IN(CI)
N$214: U$120.D_OUT(DO) U$121.D_IN(DI)
N$215: U$120.CL_OUT(CO) U$121.C_IN(CI)
N$216: U$98.D_OUT(DO) U$99.D_IN(DI)
N$217: U$98.CL_OUT(CO) U$99.C_IN(CI)
N$218: U$105.D_OUT(DO) U$106.D_IN(DI)
N$219: U$105.CL_OUT(CO) U$106.C_IN(CI)
N$220: U$106.D_OUT(DO) U$107.D_IN(DI)
N$221: U$106.CL_OUT(CO) U$107.C_IN(CI)
N$222: U$107.D_OUT(DO) U$108.D_IN(DI)
N$223: U$107.CL_OUT(CO) U$108.C_IN(CI)
N$224: U$108.D_OUT(DO) U$109.D_IN(DI)
N$225: U$108.CL_OUT(CO) U$109.C_IN(CI)
N$226: U$109.D_OUT(DO) U$110.D_IN(DI)
N$227: U$109.CL_OUT(CO) U$110.C_IN(CI)
N$228: U$111.D_OUT(DO) U$112.D_IN(DI)
N$229: U$111.CL_OUT(CO) U$112.C_IN(CI)
N$230: U$112.D_OUT(DO) U$113.D_IN(DI)
N$231: U$112.CL_OUT(CO) U$113.C_IN(CI)
N$232: U$113.D_OUT(DO) U$114.D_IN(DI)
N$233: U$113.CL_OUT(CO) U$114.C_IN(CI)
N$234: U$114.D_OUT(DO) U$115.D_IN(DI)
N$235: U$114.CL_OUT(CO) U$115.C_IN(CI)
N$236: U$115.D_OUT(DO) U$116.D_IN(DI)
N$237: U$115.CL_OUT(CO) U$116.C_IN(CI)
N$238: U$110.D_OUT(DO) U$111.D_IN(DI)
N$239: U$110.CL_OUT(CO) U$111.C_IN(CI)
N$240: U$92.CL_OUT(CO) U$93.C_IN(CI)
N$241: U$92.D_OUT(DO) U$93.D_IN(DI)
N$242: U$103.CL_OUT(CO) U$105.C_IN(CI)
N$243: U$103.D_OUT(DO) U$105.D_IN(DI)
N$244: U$117.D_OUT(DO) U$118.D_IN(DI)
N$245: U$117.CL_OUT(CO) U$118.C_IN(CI)
N$246: U$121.D_OUT(DO) U$122.D_IN(DI)
N$247: U$121.CL_OUT(CO) U$122.C_IN(CI)
N$248: U$116.D_OUT(DO) U$117.D_IN(DI)
N$249: U$116.CL_OUT(CO) U$117.C_IN(CI)
N$250: U$122.D_OUT(DO) U$123.D_IN(DI)
N$251: U$122.CL_OUT(CO) U$123.C_IN(CI)
N$252: U$124.D_OUT(DO) U$125.D_IN(DI)
N$253: U$124.CL_OUT(CO) U$125.C_IN(CI)
N$254: U$125.D_OUT(DO) U$126.D_IN(DI)
N$255: U$125.CL_OUT(CO) U$126.C_IN(CI)
N$256: U$126.D_OUT(DO) U$127.D_IN(DI)
N$257: U$126.CL_OUT(CO) U$127.C_IN(CI)
N$258: U$127.D_OUT(DO) U$128.D_IN(DI)
N$259: U$127.CL_OUT(CO) U$128.C_IN(CI)
N$260: U$128.D_OUT(DO) U$129.D_IN(DI)
N$261: U$128.CL_OUT(CO) U$129.C_IN(CI)
N$262: U$123.D_OUT(DO) U$124.D_IN(DI)
N$263: U$123.CL_OUT(CO) U$124.C_IN(CI)
N$264: U$31.D_OUT(DO) U$130.D_IN(DI)
N$265: U$31.CL_OUT(CO) U$130.C_IN(CI)
N$266: U$104.C_IN(CI) U$130.CL_OUT(CO)
N$267: U$104.D_IN(DI) U$130.D_OUT(DO)
N$268: U$32.D_IN(DI) U$129.D_OUT(DO)
N$269: U$32.C_IN(CI) U$129.CL_OUT(CO)
VIN: SJ1.2 ; also sheet 3
Unconnected: U$118.CL_OUT(CO) U$118.D_OUT(DO)

## Sheet 3 of 3
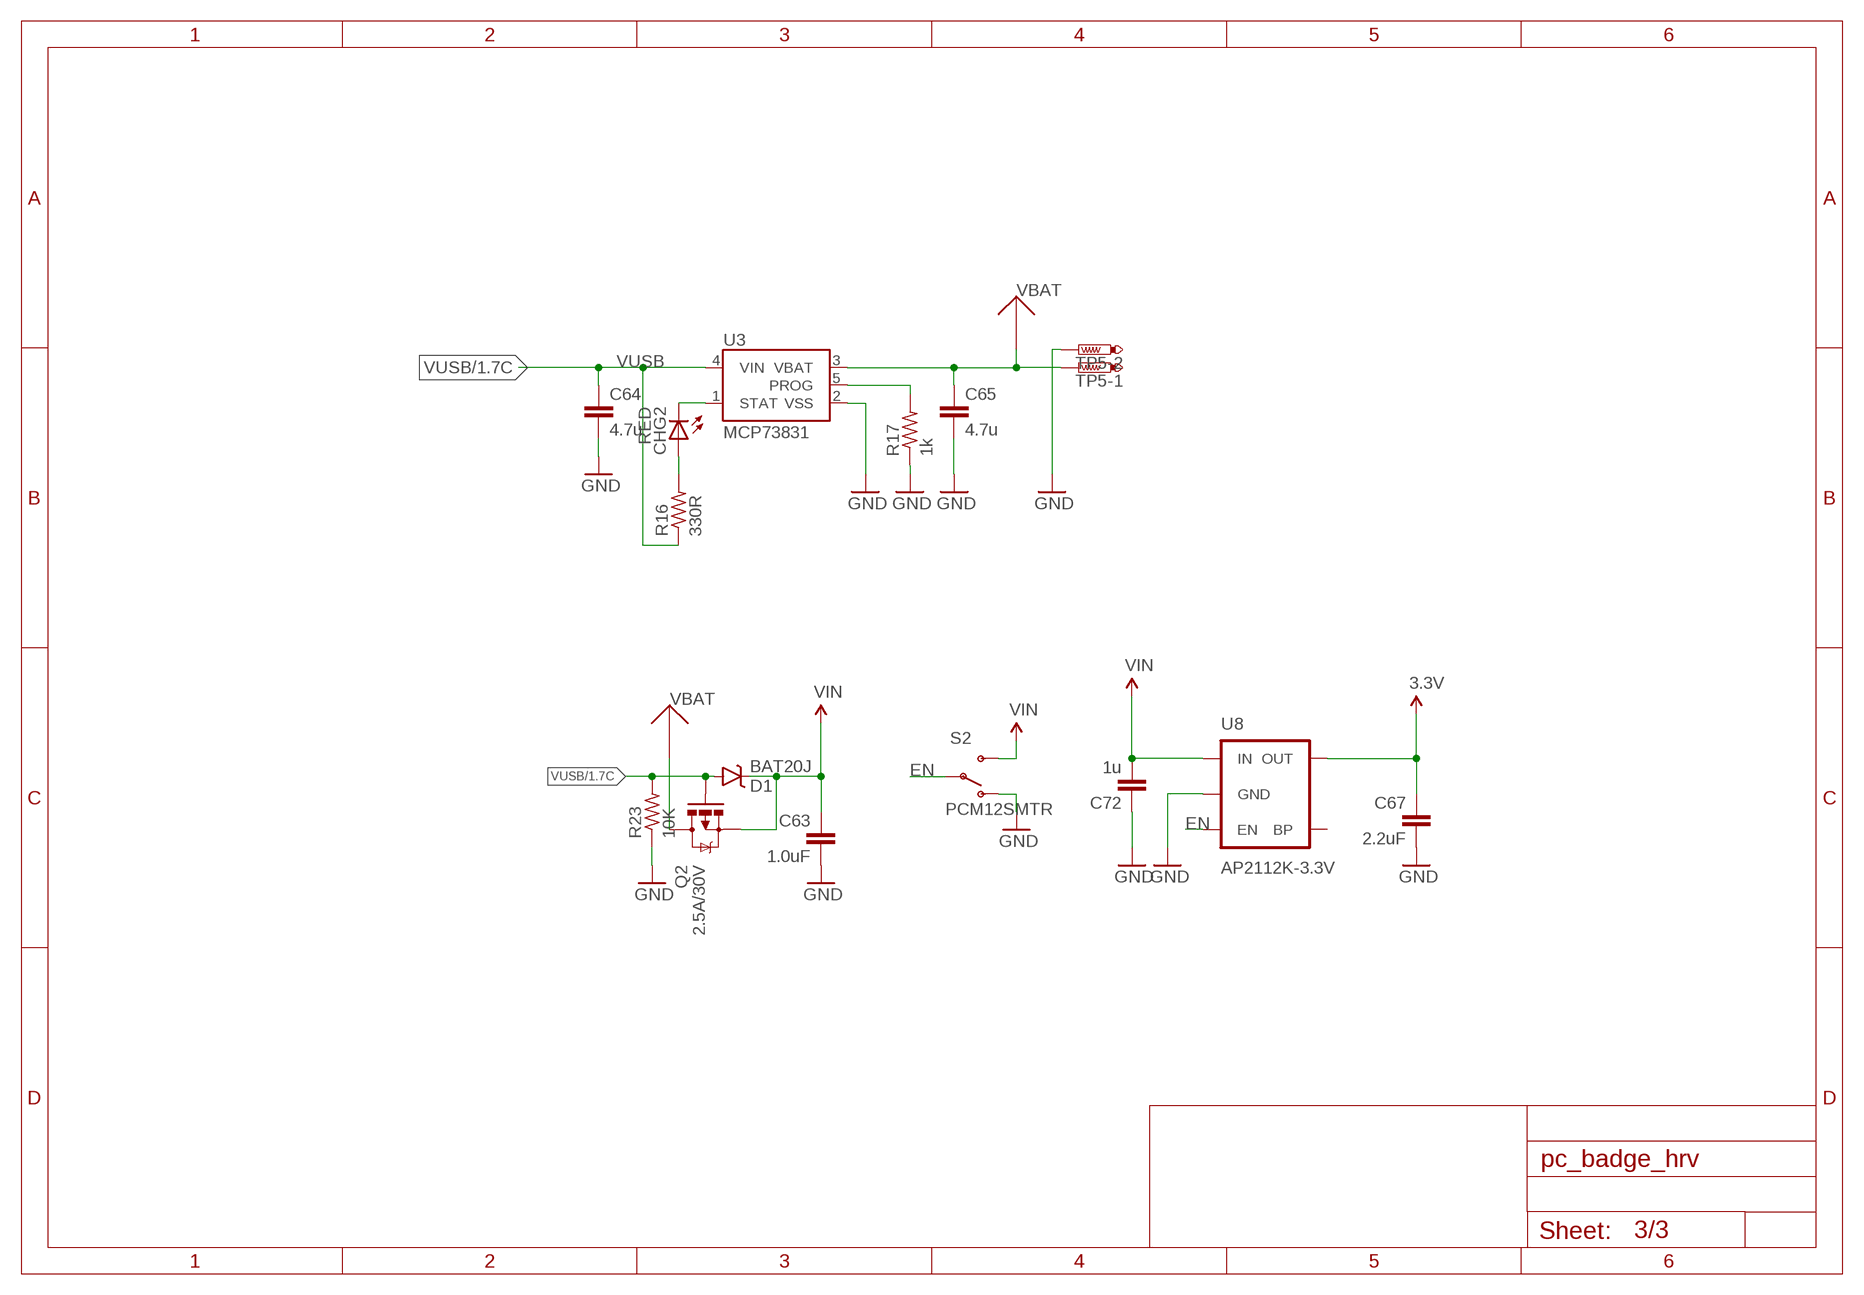
[diagram p2: schematic, sheet 3]

### Parts
C63  1.0uF  C-EUC0402  [C0402]
C64  4.7u  C-EUC0805  [C0805]
C65  4.7u  C-EUC0805  [C0805]
C67  2.2uF  C-EUC0402  [C0402]
C72  1u  C-EUC0402  [C0402]
CHG2  RED  LEDCHIPLED_0603  [CHIPLED_0603]
D1  BAT20J  DIODE-SCHOTTKY-BAT20J  [SOD-323]
Q2  2.5A/30V  MOSFET-PCHANNELDMG2307L  [SOT23-3]
R16  330R  R-US_R0402  [R0402]
R17  1k  R-US_R0402  [R0402]
R23  10K  R-US_R0402  [R0402]
S2  PCM12SMTR  SWITCH-SPDT-SMD-A  [SWITCH-SPST-SMD-A]
TP5  PTR2  [P2-38-17]
U3  MCP73831  [SOT23-5]
U8  AP2112K-3.3V  V_REG_LDOSMD  [SOT23-5]

### Nets
3.3V: C67.1 U8.5(OUT) ; also sheet 1
EN: S2.2(P) U8.3(EN)
GND: C63.2 C64.2 C65.2 C67.2 C72.1 R17.1 R23.1 S2.1(O) TP5.TP-2 U3.2(VSS) U8.2(GND) ; also sheet 1,2
N$22: CHG2.C U3.1(STAT)
N$29: CHG2.A R16.2
N$31: R17.2 U3.5(PROG)
VBAT: C65.1 Q2.3(D) TP5.TP-1 U3.3(VBAT) ; also sheet 1
VIN: C63.1 C72.2 D1.C Q2.2(S) S2.3(S) U8.1(IN) ; also sheet 2
VUSB: C64.1 D1.A Q2.1(G) R16.1 R23.2 U3.4(VIN) ; also sheet 1
Unconnected: U8.4(BP)

## Power pins joined to a net without a drawn wire
IO12: IC1.18(IO12)
SENSOR_CAPN: IC1.7(SENSOR_CAPN)

## Library data of the parts
C1 C3-C5 C9 C10 C12 C14 C16-C47 C50-C56 C59-C79 C83-C118 = rcl:C-EU: CAPACITOR, European symbol
C2 C6-C8 C11 = SparkFun-Capacitors:0.1UF: 0.1µF ceramic capacitors A capacitor is a passive two-terminal electrical component used to store electrical energy temporarily in an electric field.; PROD_ID: CAP-12416
C13 C15 = SparkFun-Capacitors:10UF: 10.0µF ceramic capacitors A capacitor is a passive two-terminal electrical component used to store electrical energy temporarily in an electric field.; PROD_ID: CAP-11015
C48 = esp32-thing-temp:2.4PF: 2.4pF ceramic capacitors A capacitor is a passive two-terminal electrical component used to store electrical energy temporarily in an electric field.; PROD_ID: CAP-13541
C49 = esp32-thing-temp:5.6PF-50V-5%(0603): CAP-12456; PROD_ID: CAP-12456
C57 C58 = SparkFun-Capacitors:15PF: 15pF ceramic capacitors A capacitor is a passive two-terminal electrical component used to store electrical energy temporarily in an electric field.; PROD_ID: CAP-07881
C80-C82 = microbuilder:CAP_CERAMIC: Ceramic Capacitors For new designs, use the packages preceded by an '_' character since they are more reliable: The following footprints should be used on most boards: _0402 - Standard footprint for regular board layouts _0603 - Standard footprint for regular board layouts _0805 - Standard footprint for regular board layouts _1206 - Standard footprint for regular board layouts For extremely tight-pitch boards where space is at a premium, the following 'micro-pitch' footprints can be used (smaller pads, no silkscreen outline, etc.): _0402MP - Micro-pitch footprint for very dense/compact boards _0603MP - Micro-pitch footprint for very dense/compact boards _0805MP - Micro-pitch footprint for very dense/compact boards _1206MP - Micro-pitch footprint for very dense/compact boards
CHG2 = led:LED: LED OSRAM: - CHIPLED LG R971, LG N971, LY N971, LG Q971, LY Q971, LO R971, LY R971 LH N974, LH R974 LS Q976, LO Q976, LY Q976 LO Q996 - Hyper CHIPLED LW Q18S LB Q993, LB Q99A, LB R99A - SideLED LS A670, LO A670, LY A670, LG A670, LP A670 LB A673, LV A673, LT A673, LW A673 LH A674 LY A675 LS A676, LA A676, LO A676, LY A676, LW A676 LS A679, LY A679, LG A679 - Hyper Micro SIDELED® LS Y876, LA Y876, LO Y876, LY Y876 LT Y87S - SmartLED LW L88C, LW L88S LB L89C, LB L89S, LG L890 LS L89K, LO L89K, LY L89K LS L896, LA L896, LO L896, LY L896 - TOPLED LS T670, LO T670, LY T670, LG T670, LP T670 LSG T670, LSP T670, LSY T670, LOP T670, LYG T670 LG T671, LOG T671, LSG T671 LB T673, LV T673, LT T673, LW T673 LH T674 LS T676, LA T676, LO T676, LY T676, LB T676, LH T676, LSB T676, LW T676 LB T67C, LV T67C, LT T67C, LS T67K, LO T67K, LY T67K, LW E67C LS E67B, LA E67B, LO E67B, LY E67B, LB E67C, LV E67C, LT E67C LW T67C LS T679, LY T679, LG T679 LS T770, LO T770, LY T770, LG T770, LP T770 LB T773, LV T773, LT T773, LW T773 LH T774 LS E675, LA E675, LY E675, LS T675 LS T776, LA T776, LO T776, LY T776, LB T776 LHGB T686 LT T68C, LB T68C - Hyper Mini TOPLED® LB M676 - Mini TOPLED Santana® LG M470 LS M47K, LO M47K, LY M47K Source: http://www.osram.convergy.de LUXEON: - LUMILED® LXK2-PW12-R00, LXK2-PW12-S00, LXK2-PW14-U00, LXK2-PW14-V00 LXK2-PM12-R00, LXK2-PM12-S00, LXK2-PM14-U00 LXK2-PE12-Q00, LXK2-PE12-R00, LXK2-PE12-S00, LXK2-PE14-T00, LXK2-PE14-U00 LXK2-PB12-K00, LXK2-PB12-L00, LXK2-PB12-M00, LXK2-PB14-N00, LXK2-PB14-P00, LXK2-PB14-Q00 LXK2-PR12-L00, LXK2-PR12-M00, LXK2-PR14-Q00, LXK2-PR14-R00 LXK2-PD12-Q00, LXK2-PD12-R00, LXK2-PD12-S00 LXK2-PH12-R00, LXK2-PH12-S00 LXK2-PL12-P00, LXK2-PL12-Q00, LXK2-PL12-R00 Source: www.luxeon.com KINGBRIGHT: KA-3528ASYC Source: www.kingbright.com
D1 = SparkFun-DiscreteSemi:DIODE-SCHOTTKY: Schottky diodes in SFE's production catalog BAT20J 1A 23V 0.62Vf RB751 120mA 40V 0.37Vf PMEG4005EJ 0.5A 40V 0.42Vf MBRA140 1A 40V 0.5Vf B340A 3A 40V SMA; PROD_ID: DIO-11623
E1 = esp32-thing-temp:ANTENNA: Chip antenna Chip antenna with ground or secondary connection. Common with larger metal RF connectors.
H1 H2 = holes:MOUNT-PAD-ROUND: MOUNTING PAD, round
IC1 = cypresspsoc_0.30:CY8C29666_QFN48
JP7 = circuitects:MICRO-B
L1 = SparkFun-Passives:INDUCTOR: Inductors Basic Inductor/Choke - 0603 and 1206. Footprints are not proven and vary greatly between part numbers. INDUCTOR POWER 3.3UH 4.0A SMD 0.197" L x 0.197" W x 0.177" H (5.00mm x 5.00mm x 4.50mm); PROD_ID: NDUC-08762
LOGO3 = ohw-logo:OSHW_LOGO_FILL
Q1 = esp32-thing-temp:MBT3904DW1T1: MBT3904DW1 Dual NPN Transistors The MBT3904W1 puts two general purpose 3904 NPN transistors in a single package. Datasheet <http://www.onsemi.com/pub_link/Collateral/MBT3904DW1T1-D.PDF>; PROD_ID: TRANS-13337
Q2 = SparkFun-DiscreteSemi:MOSFET-PCHANNEL: Generic PMOSFET IRLML2244 - TRANS-11153 (SOT-23 -20V -4.3A) (1.Gate 2.Source 3.Drain) FQP27P06 - COM-10349 <http://www.sparkfun.com/products/10349> (TO-220 -60V -27A) (1.Gate 2.Source 3.Drain); PROD_ID: TRANS-11308
R1 R3 R4 R6 R7 = SparkFun:RESISTOR: Resistor Basic schematic elements and footprints for 0603, 1206, and PTH resistors.
R8 R11 R25 R26 = SparkFun-Resistors:10KOHM-1/10W-1%(0603): RES-00824; PROD_ID: RES-00824; VALUE: 10K
R9 R10 = SparkFun-Resistors:10KOHM: 10kΩ resistor A resistor is a passive two-terminal electrical component that implements electrical resistance as a circuit element. Resistors act to reduce current flow, and, at the same time, act to lower voltage levels within circuits. - Wikipedia; PROD_ID: RES-00824
R12-R17 R19 R23 = rcl:R-US_: RESISTOR, American symbol
S2 = SparkFun-Electromechanical:SWITCH-SPDT: SPDT Switch Simple slide switch, Spark Fun Electronics SKU : COM-00102 DPDT SMT slide switch, AYZ0202, SWCH-08179; PROD_ID: SWCH-10651
SJ1 = SparkFun:SOLDERJUMPER: Solder Jumper Standard SMD solder jumper. Used to automate production. Two varients : Normally Open and Normally Closed are the same, but have different paste layers. NC will have a large amount of paste and should jumper during reflow.
SW2 = microbuilder:SWITCH_TACT_SMT: SMT Tact Switches 6x6mm - Digikey: P12940SCT-ND KMR2 (4.6x2.8mm) - Digikey: 401-1426-1-ND EVQ-PQHB55 - Light Touch, 160GF (4.5x4.5mm) - Digikey: P8090SCT-ND KMT0 - KMT021 NGJ LHS (etc.) IP68/Waterproof - Digikey: CKN10289CT-ND
TP1 TP2 = testpad:TPSQ: Test pad
TP5 = testpad:PTR2: TEST PIN
U1 = SparkFun-DigitalIC:FT231X: FTDI FT231X Full Speed USB to Full-handshake UART This USB2.0 Full Speed IC offers a compact bridge to full handshake UART interfaces. The device is a UART, capable of operating up to 3MBaud, with low power consumption (8mA). The FT231X includes the complete FT-X series feature set and enables USB to be added into a system design quickly and easily over a UART interface.; PROD_ID: IC-11524; VALUE: FT231XS
U2 = LSM6DS3:LSM6DS3
U3 = SparkFun:MCP73831: Microchip's MCP73831 Miniature single cell, fully integrated Li-Ion, Li-polymer charge management controller http://ww1.microchip.com/downloads/en/DeviceDoc/21984a.pdf
U8 = SparkFun-PowerIC:V_REG_LDO: Voltage Regulator LDO Standard 150mA LDO voltage regulator in SOT-23 layout. Micrel part MIC5205. BP (by-pass) pin is used to lower output noise with 470pF cap.; PROD_ID: VREG-12457
U$9-U$15 U$18-U$22 U$24 U$25 U$27-U$130 = jos-ph:APA102: APA102C 5050 RGB LED -- Adafruit DotStar Single LED Pixel Product Page: https://www.adafruit.com/products/2343 Datasheet: https://cdn-shop.adafruit.com/product-files/2343/APA102C.pdf
U$131 = circuitects:MAX30003
U$134 = circuitects:SIT1533
Y1 = SparkFun-Clocks:CRYSTAL-32.768KHZ: 32.768kHz Crystal Frequency: 32.768kHz Frequency Stability: ±20ppm Load Capacitance: 12.5pF (PTH-2X6 & SMD-3.2X1.5), 6pF (SMD-2X6); PROD_ID: XTAL-13062

## Net classes
2 gnd: width 0.102 mm, drill 0.1 mm
4 USBpair: width 0.102 mm, drill 0.1 mm, clearance 0.15 mm to class 3